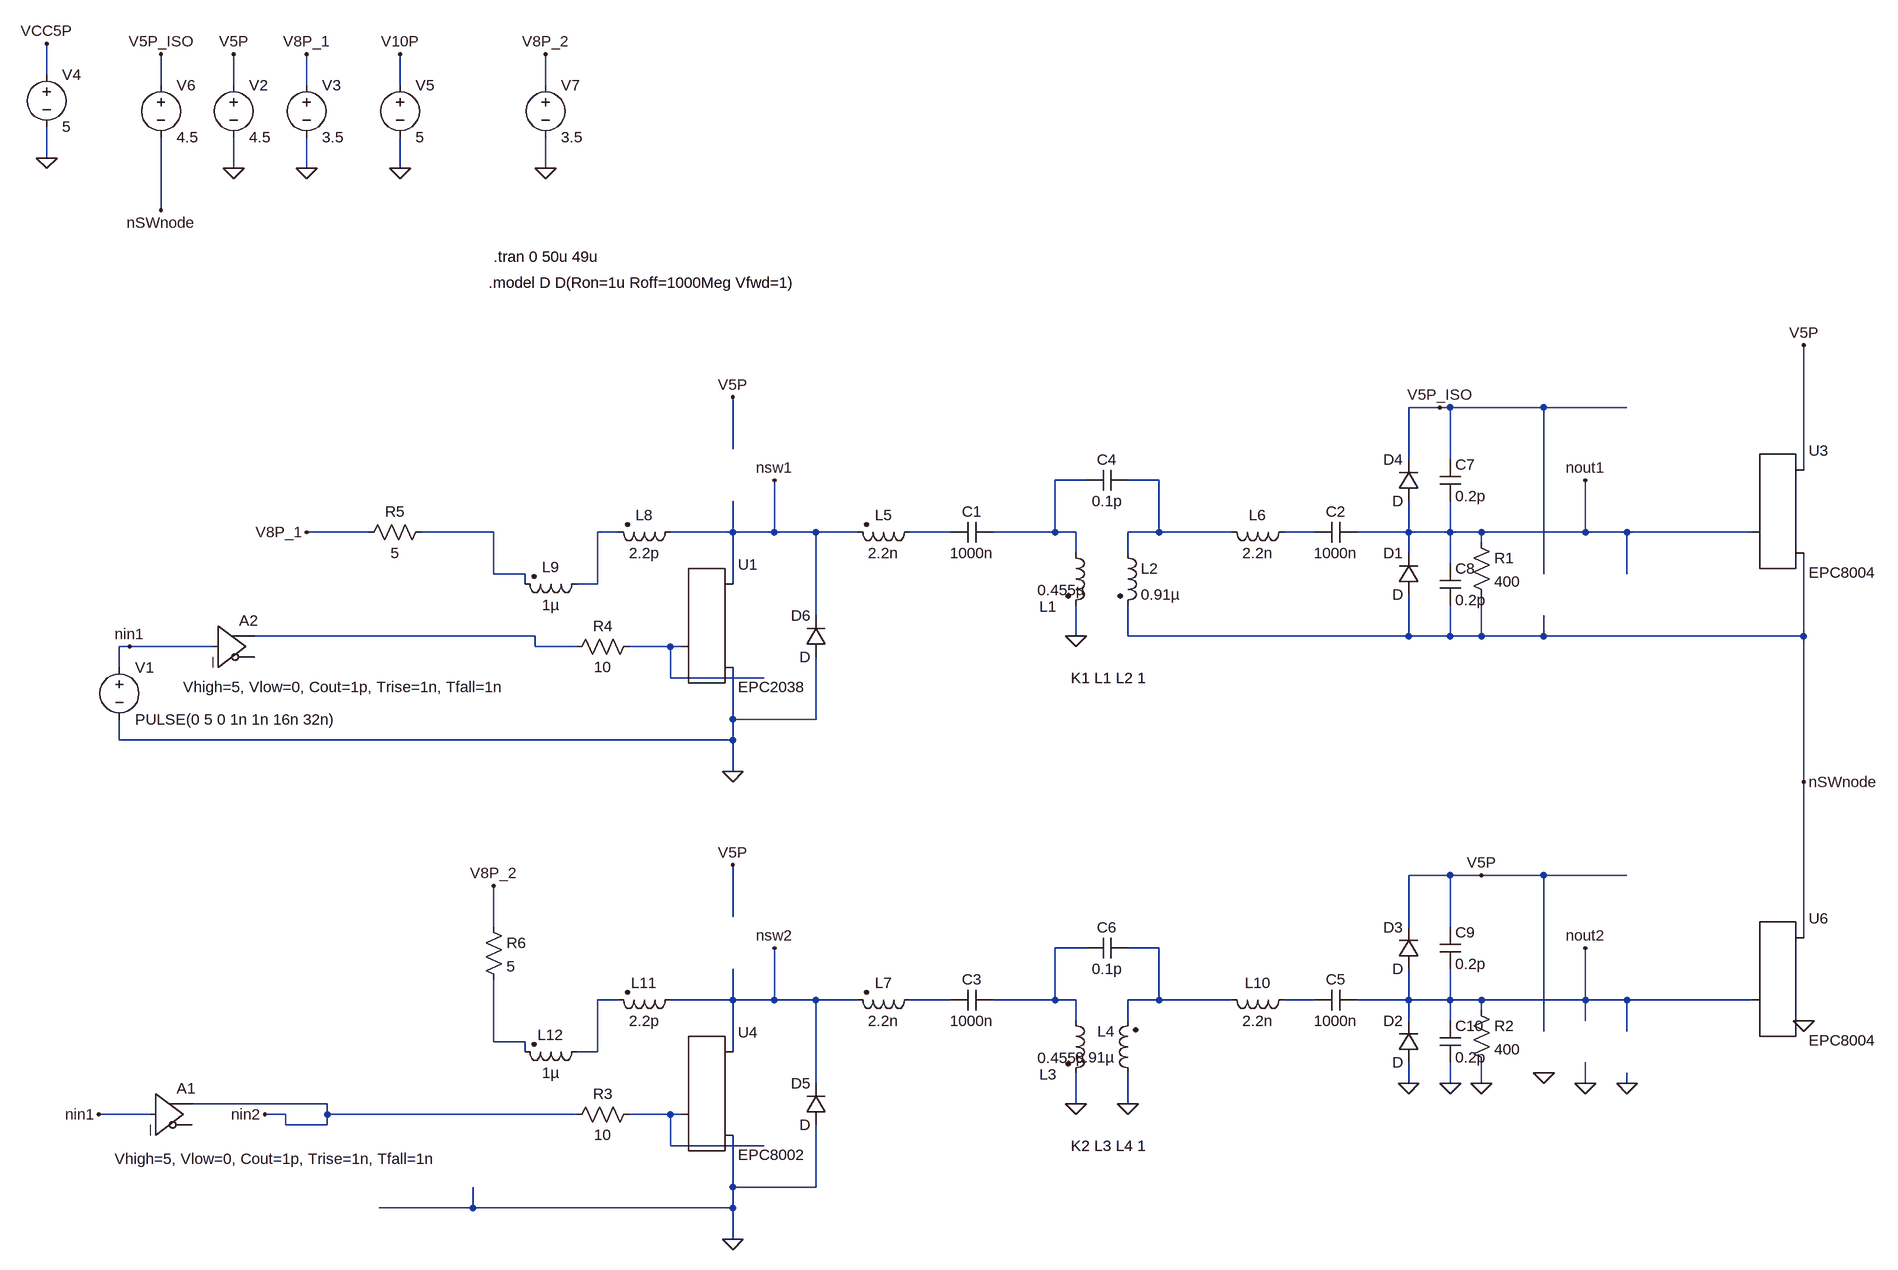
[diagram p0: schematic Ultrafast GD - 10232023.asc]
Ultrafast GD - 10232023.asc, the LTspice schematic file:
Version 4
SHEET 1 1588 1396
WIRE -1280 -704 -1280 -752
WIRE -1104 -688 -1104 -736
WIRE -992 -688 -992 -736
WIRE -880 -688 -880 -736
WIRE -736 -688 -736 -736
WIRE -512 -688 -512 -736
WIRE -1280 -576 -1280 -624
WIRE -992 -560 -992 -608
WIRE -880 -560 -880 -608
WIRE -736 -560 -736 -608
WIRE -512 -560 -512 -608
WIRE -1104 -496 -1104 -608
WIRE 864 -192 816 -192
WIRE 880 -192 864 -192
WIRE 1024 -192 880 -192
WIRE 1152 -192 1024 -192
WIRE -224 -128 -224 -208
WIRE 816 -112 816 -192
WIRE 880 -112 880 -192
WIRE 1424 -96 1424 -288
WIRE 320 -80 272 -80
WIRE 432 -80 384 -80
WIRE -784 0 -880 0
WIRE -592 0 -704 0
WIRE -400 0 -432 0
WIRE -224 0 -224 -48
WIRE -224 0 -320 0
WIRE -160 0 -160 -80
WIRE -160 0 -224 0
WIRE -96 0 -160 0
WIRE -32 0 -96 0
WIRE 112 0 48 0
WIRE 272 0 272 -80
WIRE 272 0 176 0
WIRE 304 0 272 0
WIRE 432 0 432 -80
WIRE 432 0 384 0
WIRE 544 0 432 0
WIRE 672 0 624 0
WIRE 816 0 816 -48
WIRE 816 0 736 0
WIRE 880 0 880 -48
WIRE 880 0 816 0
WIRE 928 0 880 0
WIRE 1088 0 1088 -80
WIRE 1088 0 928 0
WIRE 1152 0 1088 0
WIRE 1344 0 1152 0
WIRE 928 16 928 0
WIRE 304 32 304 0
WIRE 384 32 384 0
WIRE 816 32 816 0
WIRE 880 48 880 0
WIRE -592 64 -592 0
WIRE -544 64 -592 64
WIRE 1024 64 1024 -192
WIRE 1152 64 1152 0
WIRE -544 80 -544 64
WIRE -432 80 -432 0
WIRE -432 80 -464 80
WIRE -224 80 -224 0
WIRE -96 128 -96 0
WIRE -528 160 -960 160
WIRE 304 160 304 112
WIRE 384 160 384 112
WIRE 816 160 816 96
WIRE 816 160 384 160
WIRE 880 160 880 112
WIRE 880 160 816 160
WIRE 928 160 928 96
WIRE 928 160 880 160
WIRE 1024 160 1024 128
WIRE 1024 160 928 160
WIRE 1424 160 1424 32
WIRE 1424 160 1024 160
WIRE -1152 176 -1168 176
WIRE -1024 176 -1152 176
WIRE -528 176 -528 160
WIRE -464 176 -528 176
WIRE -320 176 -384 176
WIRE -304 176 -320 176
WIRE -1168 208 -1168 176
WIRE -320 224 -320 176
WIRE -176 224 -320 224
WIRE -224 288 -224 208
WIRE -96 288 -96 192
WIRE -96 288 -224 288
WIRE -1168 320 -1168 288
WIRE -224 320 -224 288
WIRE -224 320 -1168 320
WIRE -224 368 -224 320
WIRE 1424 384 1424 160
WIRE 880 528 816 528
WIRE 928 528 880 528
WIRE 1024 528 928 528
WIRE 1152 528 1024 528
WIRE -224 592 -224 512
WIRE -592 608 -592 544
WIRE 816 608 816 528
WIRE 880 608 880 528
WIRE 1424 624 1424 384
WIRE 320 640 272 640
WIRE 432 640 384 640
WIRE -400 720 -432 720
WIRE -224 720 -224 672
WIRE -224 720 -320 720
WIRE -160 720 -160 640
WIRE -160 720 -224 720
WIRE -96 720 -160 720
WIRE -32 720 -96 720
WIRE 112 720 48 720
WIRE 272 720 272 640
WIRE 272 720 176 720
WIRE 304 720 272 720
WIRE 432 720 432 640
WIRE 432 720 384 720
WIRE 544 720 432 720
WIRE 672 720 624 720
WIRE 816 720 816 672
WIRE 816 720 736 720
WIRE 880 720 880 672
WIRE 880 720 816 720
WIRE 928 720 880 720
WIRE 1088 720 1088 640
WIRE 1088 720 928 720
WIRE 1152 720 1088 720
WIRE 1344 720 1152 720
WIRE 928 736 928 720
WIRE 304 752 304 720
WIRE 384 752 384 720
WIRE 816 752 816 720
WIRE 880 752 880 720
WIRE 1088 752 1088 720
WIRE 1024 768 1024 528
WIRE 1152 768 1152 720
WIRE -592 784 -592 688
WIRE -544 784 -592 784
WIRE -544 800 -544 784
WIRE -432 800 -432 720
WIRE -432 800 -464 800
WIRE -224 800 -224 720
WIRE -96 848 -96 720
WIRE 816 848 816 816
WIRE 880 848 880 816
WIRE 928 848 928 816
WIRE 1088 848 1088 816
WIRE 1152 848 1152 832
WIRE -848 880 -1056 880
WIRE 304 880 304 832
WIRE 384 880 384 832
WIRE -1120 896 -1200 896
WIRE -912 896 -944 896
WIRE -848 896 -848 880
WIRE -464 896 -848 896
WIRE -320 896 -384 896
WIRE -304 896 -320 896
WIRE -912 912 -912 896
WIRE -848 912 -848 896
WIRE -848 912 -912 912
WIRE -320 944 -320 896
WIRE -176 944 -320 944
WIRE -224 1008 -224 928
WIRE -96 1008 -96 912
WIRE -96 1008 -224 1008
WIRE -624 1040 -624 1008
WIRE -624 1040 -768 1040
WIRE -224 1040 -224 1008
WIRE -224 1040 -624 1040
WIRE -224 1088 -224 1040
FLAG 304 160 0
FLAG -992 -560 0
FLAG -992 -736 V5P
FLAG -224 -208 V5P
FLAG -880 -560 0
FLAG -880 -736 V8P_1
FLAG -224 368 0
FLAG -880 0 V8P_1
FLAG 1088 -80 nout1
FLAG -1152 176 nin1
FLAG -160 -80 nsw1
FLAG -736 -560 0
FLAG -736 -736 V10P
FLAG 1424 -288 V5P
FLAG 304 880 0
FLAG 384 880 0
FLAG 816 848 0
FLAG 928 848 0
FLAG 1088 848 0
FLAG -224 512 V5P
FLAG -224 1088 0
FLAG -592 544 V8P_2
FLAG 1088 640 nout2
FLAG -944 896 nin2
FLAG -160 640 nsw2
FLAG 1424 752 0
FLAG -1104 -736 V5P_ISO
FLAG 1424 384 nSWnode
FLAG -1104 -496 nSWnode
FLAG -512 -560 0
FLAG -512 -736 V8P_2
FLAG -1200 896 nin1
FLAG -1280 -576 0
FLAG -1280 -752 VCC5P
FLAG 1024 832 0
FLAG 1152 848 0
FLAG 864 -192 V5P_ISO
FLAG 928 528 V5P
FLAG 880 848 0
SYMBOL voltage -1168 192 R0
WINDOW 123 0 0 Left 0
WINDOW 39 0 0 Left 0
SYMATTR InstName V1
SYMATTR Value PULSE(0 5 0 1n 1n 16n 32n)
SYMBOL ind2 288 16 R0
WINDOW 0 -40 98 Left 2
WINDOW 3 -43 73 Left 2
SYMATTR InstName L1
SYMATTR Value 0.455µ
SYMATTR Type ind
SYMBOL ind2 368 16 R0
SYMATTR InstName L2
SYMATTR Value 0.91µ
SYMATTR Type ind
SYMBOL cap 176 -16 R90
WINDOW 0 0 32 VBottom 2
WINDOW 3 32 32 VTop 2
SYMATTR InstName C1
SYMATTR Value 1000n
SYMBOL cap 736 -16 R90
WINDOW 0 0 32 VBottom 2
WINDOW 3 32 32 VTop 2
SYMATTR InstName C2
SYMATTR Value 1000n
SYMBOL res 912 0 R0
SYMATTR InstName R1
SYMATTR Value 400
SYMBOL diode 832 96 R180
WINDOW 0 24 64 Left 2
WINDOW 3 24 0 Left 2
SYMATTR InstName D1
SYMBOL EPCGaN -304 176 R0
SYMATTR InstName U1
SYMATTR Value EPC2038
SYMBOL voltage -992 -704 R0
WINDOW 123 0 0 Left 0
WINDOW 39 0 0 Left 0
SYMATTR InstName V2
SYMATTR Value 4.5
SYMBOL voltage -880 -704 R0
WINDOW 123 0 0 Left 0
WINDOW 39 0 0 Left 0
SYMATTR InstName V3
SYMATTR Value 3.5
SYMBOL res -368 160 R90
WINDOW 0 0 56 VBottom 2
WINDOW 3 32 56 VTop 2
SYMATTR InstName R4
SYMATTR Value 10
SYMBOL ind2 64 -16 R90
WINDOW 0 5 56 VBottom 2
WINDOW 3 32 56 VTop 2
SYMATTR InstName L5
SYMATTR Value 2.2n
SYMATTR SpiceLine Rser=0.2
SYMATTR Type ind
SYMBOL ind 640 -16 R90
WINDOW 0 5 56 VBottom 2
WINDOW 3 32 56 VTop 2
SYMATTR InstName L6
SYMATTR Value 2.2n
SYMATTR SpiceLine Rser=0.2
SYMBOL ind2 -304 -16 R90
WINDOW 0 5 56 VBottom 2
WINDOW 3 32 56 VTop 2
SYMATTR InstName L8
SYMATTR Value 2.2p
SYMATTR Type ind
SYMBOL cap 384 -96 R90
WINDOW 0 0 32 VBottom 2
WINDOW 3 32 32 VTop 2
SYMATTR InstName C4
SYMATTR Value 0.1p
SYMBOL voltage -736 -704 R0
WINDOW 123 0 0 Left 0
WINDOW 39 0 0 Left 0
SYMATTR InstName V5
SYMATTR Value 5
SYMBOL ind2 -448 64 R90
WINDOW 0 5 56 VBottom 2
WINDOW 3 32 56 VTop 2
SYMATTR InstName L9
SYMATTR Value 1µ
SYMATTR Type ind
SYMBOL EPCGaN 1344 0 R0
SYMATTR InstName U3
SYMATTR Value EPC8004
SYMBOL ind2 288 736 R0
WINDOW 0 -40 98 Left 2
WINDOW 3 -43 73 Left 2
SYMATTR InstName L3
SYMATTR Value 0.455µ
SYMATTR Type ind
SYMBOL ind2 400 848 R180
WINDOW 0 36 80 Left 2
WINDOW 3 36 40 Left 2
SYMATTR InstName L4
SYMATTR Value 0.91µ
SYMATTR Type ind
SYMBOL cap 176 704 R90
WINDOW 0 0 32 VBottom 2
WINDOW 3 32 32 VTop 2
SYMATTR InstName C3
SYMATTR Value 1000n
SYMBOL cap 736 704 R90
WINDOW 0 0 32 VBottom 2
WINDOW 3 32 32 VTop 2
SYMATTR InstName C5
SYMATTR Value 1000n
SYMBOL res 912 720 R0
SYMATTR InstName R2
SYMATTR Value 400
SYMBOL diode 832 816 R180
WINDOW 0 24 64 Left 2
WINDOW 3 24 0 Left 2
SYMATTR InstName D2
SYMBOL EPCGaN -304 896 R0
SYMATTR InstName U4
SYMATTR Value EPC8002
SYMBOL res -368 880 R90
WINDOW 0 0 56 VBottom 2
WINDOW 3 32 56 VTop 2
SYMATTR InstName R3
SYMATTR Value 10
SYMBOL ind2 64 704 R90
WINDOW 0 5 56 VBottom 2
WINDOW 3 32 56 VTop 2
SYMATTR InstName L7
SYMATTR Value 2.2n
SYMATTR SpiceLine Rser=0.2
SYMATTR Type ind
SYMBOL ind 640 704 R90
WINDOW 0 5 56 VBottom 2
WINDOW 3 32 56 VTop 2
SYMATTR InstName L10
SYMATTR Value 2.2n
SYMATTR SpiceLine Rser=0.2
SYMBOL ind2 -304 704 R90
WINDOW 0 5 56 VBottom 2
WINDOW 3 32 56 VTop 2
SYMATTR InstName L11
SYMATTR Value 2.2p
SYMATTR Type ind
SYMBOL cap 384 624 R90
WINDOW 0 0 32 VBottom 2
WINDOW 3 32 32 VTop 2
SYMATTR InstName C6
SYMATTR Value 0.1p
SYMBOL ind2 -448 784 R90
WINDOW 0 5 56 VBottom 2
WINDOW 3 32 56 VTop 2
SYMATTR InstName L12
SYMATTR Value 1µ
SYMATTR Type ind
SYMBOL EPCGaN 1344 720 R0
SYMATTR InstName U6
SYMATTR Value EPC8004
SYMBOL voltage -1104 -704 R0
WINDOW 123 0 0 Left 0
WINDOW 39 0 0 Left 0
SYMATTR InstName V6
SYMATTR Value 4.5
SYMBOL voltage -512 -704 R0
WINDOW 123 0 0 Left 0
WINDOW 39 0 0 Left 0
SYMATTR InstName V7
SYMATTR Value 3.5
SYMBOL Digital\\buf -1024 112 R0
WINDOW 3 -46 126 Left 2
SYMATTR Value Vhigh=5, Vlow=0, Cout=1p, Trise=1n, Tfall=1n
SYMATTR InstName A2
SYMBOL Digital\\buf -1120 832 R0
WINDOW 3 -55 132 Left 2
SYMATTR Value Vhigh=5, Vlow=0, Cout=1p, Trise=1n, Tfall=1n
SYMATTR InstName A1
SYMBOL voltage -1280 -720 R0
WINDOW 123 0 0 Left 0
WINDOW 39 0 0 Left 0
SYMATTR InstName V4
SYMATTR Value 5
SYMBOL res -688 -16 R90
WINDOW 0 0 56 VBottom 2
WINDOW 3 32 56 VTop 2
SYMATTR InstName R5
SYMATTR Value 5
SYMBOL res -608 592 R0
SYMATTR InstName R6
SYMATTR Value 5
SYMBOL diode 832 672 R180
WINDOW 0 24 64 Left 2
WINDOW 3 24 0 Left 2
SYMATTR InstName D3
SYMBOL diode 832 -48 R180
WINDOW 0 24 64 Left 2
WINDOW 3 24 0 Left 2
SYMATTR InstName D4
SYMBOL diode -80 912 R180
WINDOW 0 24 64 Left 2
WINDOW 3 24 0 Left 2
SYMATTR InstName D5
SYMBOL diode -80 192 R180
WINDOW 0 24 64 Left 2
WINDOW 3 24 0 Left 2
SYMATTR InstName D6
SYMBOL cap 864 -112 R0
SYMATTR InstName C7
SYMATTR Value 0.2p
SYMBOL cap 864 48 R0
SYMATTR InstName C8
SYMATTR Value 0.2p
SYMBOL cap 864 608 R0
SYMATTR InstName C9
SYMATTR Value 0.2p
SYMBOL cap 864 752 R0
SYMATTR InstName C10
SYMATTR Value 0.2p
TEXT 296 224 Left 2 !K1 L1 L2 1
TEXT -592 -424 Left 2 !.tran 0 50u 49u
TEXT -600 -384 Left 2 !.model D D(Ron=1u Roff=1000Meg Vfwd=1)
TEXT 296 944 Left 2 !K2 L3 L4 1

The netlist it stands for:
* Ultrafast GD - 10232023.asc
V1 nin1 0 PULSE(0 5 0 1n 1n 16n 32n)
L1 N001 0 0.455µ
L2 N002 nSWnode 0.91µ
C1 N001 N005 1000n
C2 nout1 N006 1000n
R1 nout1 nSWnode 400
D1 nSWnode nout1 D
XU1 N008 nsw1 0 EPC2038
V2 V5P 0 4.5
V3 V8P_1 0 3.5
R4 N008 N007 10
L5 N005 nsw1 2.2n Rser=0.2
L6 N006 N002 2.2n Rser=0.2
L8 nsw1 N004 2.2p
C4 N002 N001 0.1p
V5 V10P 0 5
L9 N004 N003 1µ
XU3 nout1 V5P nSWnode EPC8004
L3 N009 0 0.455µ
L4 0 N010 0.91µ
C3 N009 N012 1000n
C5 nout2 N013 1000n
R2 nout2 0 400
D2 0 nout2 D
XU4 N015 nsw2 0 EPC8002
R3 N015 nin2 10
L7 N012 nsw2 2.2n Rser=0.2
L10 N013 N010 2.2n Rser=0.2
L11 nsw2 N011 2.2p
C6 N010 N009 0.1p
L12 N011 N014 1µ
XU6 nout2 nSWnode 0 EPC8004
V6 V5P_ISO nSWnode 4.5
V7 V8P_2 0 3.5
A2 nin1 0 0 0 0 0 N007 0 BUF Vhigh=5, Vlow=0, Cout=1p, Trise=1n, Tfall=1n
A1 nin1 0 0 0 0 0 nin2 0 BUF Vhigh=5, Vlow=0, Cout=1p, Trise=1n, Tfall=1n
V4 VCC5P 0 5
R5 N003 V8P_1 5
R6 V8P_2 N014 5
D3 nout2 V5P D
D4 nout1 V5P_ISO D
D5 0 nsw2 D
D6 0 nsw1 D
C7 V5P_ISO nout1 0.2p
C8 nout1 nSWnode 0.2p
C9 V5P nout2 0.2p
C10 nout2 0 0.2p
.model D D
.lib standard.dio
K1 L1 L2 1
.tran 0 50u 49u
.model D D(Ron=1u Roff=1000Meg Vfwd=1)
K2 L3 L4 1
.backanno
.end